# Altium schematic sheet microSD.SchDoc
size A3; SheetNumber: 5; SheetTotal: 8; DocumentSheetName: microSD
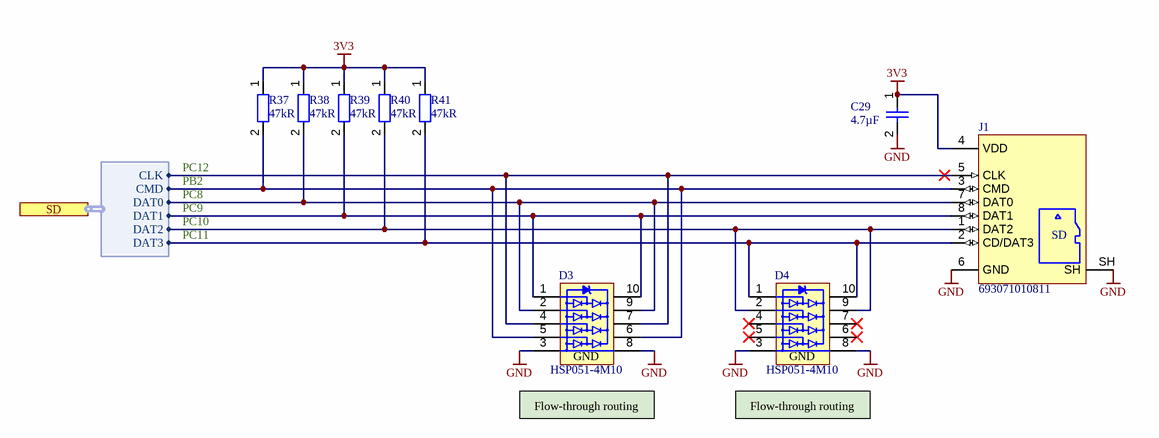
[diagram p0: microSD.SchDoc]

## Parts
C29  value 4.7µF  [CAPC1608X80N]  (hidden comment: 4.7uF/16V)
D3  HSP051-4M10  [QFN50P100X250X50-10]
D4  HSP051-4M10  [QFN50P100X250X50-10]
J1  693071010811  [WE_693071010811]
R37  47kR  [RESC1005X35N]
R38  47kR  [RESC1005X35N]
R39  47kR  [RESC1005X35N]
R40  47kR  [RESC1005X35N]
R41  47kR  [RESC1005X35N]

## Ports
SD (harness SD-Bus)

## Harnesses
SD-Bus: DAT0, DAT1, DAT2, DAT3, CLK, CMD

## Nets
3V3: C29.1 J1.4(VDD) R37.1 R38.1 R39.1 R40.1 R41.1
GND: C29.2 D3.3(GND) D3.8(GND) D4.3(GND) D4.8(GND) J1.6(GND) J1.SH
NetD3_1: D3.1(I/O1) D3.10(NC) J1.8(DAT1) R39.2 ; port SD.DAT1
NetD3_2: D3.2(I/O2) D3.9(NC) J1.7(DAT0) R38.2 ; port SD.DAT0
NetD3_4: D3.4(I/O3) D3.7(NC) J1.5(CLK) ; port SD.CLK
NetD3_5: D3.5(I/O4) D3.6(NC) J1.3(CMD) R37.2 ; port SD.CMD
NetD4_1: D4.1(I/O1) D4.10(NC) J1.2(CD/DAT3) R41.2 ; port SD.DAT3
NetD4_2: D4.2(I/O2) D4.9(NC) J1.1(DAT2) R40.2 ; port SD.DAT2

Not connected (* = marked no-connect by the designer): D4 4(I/O3)* 5(I/O4)* 6(NC)* 7(NC)*

## Notes on the sheet
- PC12
- PB2
- PC8
- PC9
- PC10
- PC11
- (near D3) Flow-through routing
- (near D4) Flow-through routing
- Sheet Name
- Project Name
- Variant:
- Doc Number
- File:
- Repo:
- Revision:
- Date:
- Author:
- VC Rev:
- Sheet
- (in symbol CMP-002-00218-19) SD

## Library data of the parts
C29 = CMP-00443-4: Cap MLCC, 4.7uF, 16V, X7R, 10%, 0603; Voltage Rating: 16V; Mounting Technology: SMD; Tolerance: 10%; Case/Package: 0603; Type: MLCC; Case Code (Metric): 1608; Dielectricum: X7R
D3 D4 = CMP-00765-5: TVS Diode, unidirectional, 4 Signal + GND,  5.8Vbr, 16A, uQFN-10, 4-line ESD Protection for high speed lines; Rated Voltage: 5.8V; Case/Package: uQFN-10; Size: L2.5B1.0H0.47; Connection: 4 Signal + GND; Mounting Technology: SMD; Peak Current: 16A; Direction: Unidirectional
J1 = CMP-002-00218-19: SD-Card Micro Connector, 8 Position, Push In, Push Out, SMD; Manufacturer: Würth; Angle: Horizontal; Connection: Pluggable; Family Name: WR-CRD; Max Voltage: 100V; Pins: 8; Type: SD-Card; Mounting Technology: SMD; Size: L15.2B14H2.1
R37-R41 = CMP-009-00137-35: Res, 47kR, 1%, 0.063W, 0402; Value: 47k; Voltage Rating: 50V; Power: 63mW; Case Code (Metric): 1005; Tolerance: 1%; Mounting Technology: SMD; Type: Fixed; Case/Package: 0402